# EAGLE design PiBackPlaneConnector-V1 (EAGLE 7.4.0)
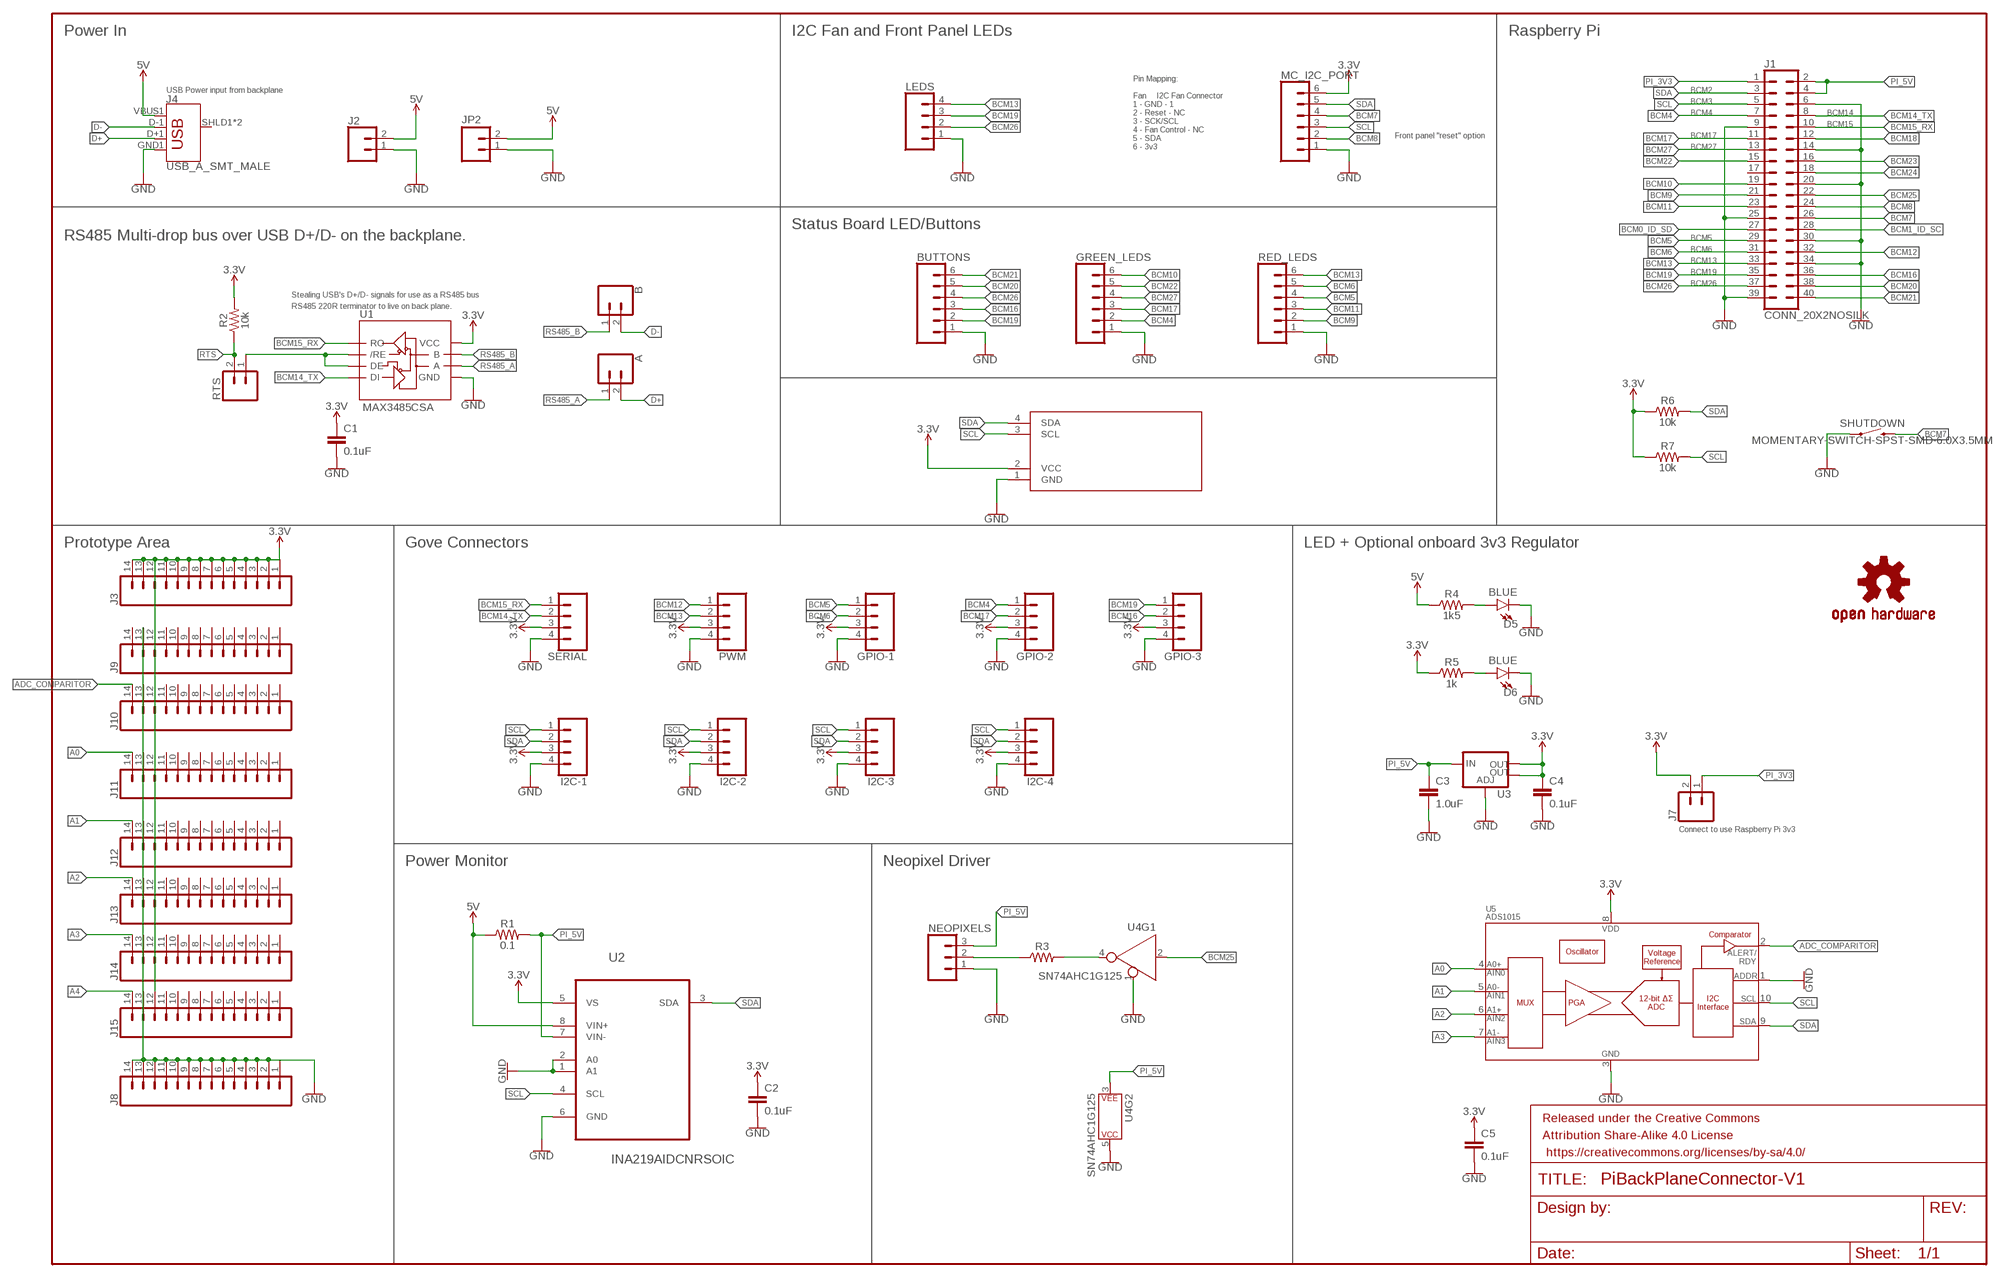
[diagram p0: schematic, sheet 1]

## Parts
A  CONN_02  [1X02]
B  CONN_02  [1X02]
BUTTONS  CONN_06SMD-1MM  [1X06-1MM]
C1  0.1uF  1.0UF-0805-25V-(+80/-20%)  [0805]
C2  0.1uF  1.0UF-0805-25V-(+80/-20%)  [0805]
C3  1.0uF  1.0UF-0805-25V-(+80/-20%)  [0805]
C4  0.1uF  1.0UF-0805-25V-(+80/-20%)  [0805]
C5  0.1uF  1.0UF-0805-25V-(+80/-20%)  [0805]
D5  BLUE  LED-BLUE1206  [LED-1206]
D6  BLUE  LED-BLUE1206  [LED-1206]
DISPLAY  DISPLAY0.91_INCH_DISPLAY  [I2C_DISPLAY_0.91_INCH]
FRAME1  FRAME-LEDGER  [CREATIVE_COMMONS]
GPIO-1  CONN_04JST-PTH-VERT  [JST-4-PTH-VERT]
GPIO-2  CONN_04JST-PTH-VERT  [JST-4-PTH-VERT]
GPIO-3  CONN_04JST-PTH-VERT  [JST-4-PTH-VERT]
GREEN_LEDS  CONN_06SMD-1MM  [1X06-1MM]
I2C-1  CONN_04JST-PTH-VERT  [JST-4-PTH-VERT]
I2C-2  CONN_04JST-PTH-VERT  [JST-4-PTH-VERT]
I2C-3  CONN_04JST-PTH-VERT  [JST-4-PTH-VERT]
I2C-4  CONN_04JST-PTH-VERT  [JST-4-PTH-VERT]
J1  CONN_20X2NOSILK  [2X20_NOSILK]
J2  CONN_02POLAR  [MOLEX-1X2]
J3  CONN_14  [1X14]
J4  USB_A_SMT_MALE  [USB-A-SMT-MALE]
J7  CONN_02  [1X02]
J8  CONN_14  [1X14]
J9  CONN_14NO_SILK  [1X14_NO_SILK]
J10  CONN_14NO_SILK  [1X14_NO_SILK]
J11  CONN_14NO_SILK  [1X14_NO_SILK]
J12  CONN_14NO_SILK  [1X14_NO_SILK]
J13  CONN_14NO_SILK  [1X14_NO_SILK]
J14  CONN_14NO_SILK  [1X14_NO_SILK]
J15  CONN_14NO_SILK  [1X14_NO_SILK]
JP2  M025MM  [SCREWTERMINAL-5MM-2@1]
LEDS  CONN_04SMD2  [1X04_1MM_RA]
LOGO1  OSHW-LOGOM  [OSHW-LOGO-M]
MC_I2C_PORT  CONN_06SMD-1MM  [1X06-1MM]
NEOPIXELS  CONN_03POLAR  [MOLEX-1X3]
PWM  CONN_04JST-PTH-VERT  [JST-4-PTH-VERT]
R1  0.1  0.1OHM-1210-1/2W-1%  [1210]
R2  10k  RESISTOR0805  [0805]
R3  RESISTOR0805  [0805]
R4  1k5  RESISTOR0805  [0805]
R5  1k  RESISTOR0805  [0805]
R6  10k  RESISTOR0805  [0805]
R7  10k  RESISTOR0805  [0805]
RED_LEDS  CONN_06SMD-1MM  [1X06-1MM]
RTS  CONN_02  [1X02]
SERIAL  CONN_04JST-PTH-VERT  [JST-4-PTH-VERT]
SHUTDOWN  MOMENTARY-SWITCH-SPST-SMD-6.0X3.5MM  [TACTILE_SWITCH_SMD_6.0X3.5MM]
U1  MAX3485CSA  RS485SOIC  [SO08]
U2  INA219AIDCNRSOIC  [SO08]
U3  V_REG_LM1117SOT223  [SOT223]
U4  SN74AHC1G125  74AHC1G125D  [SOT23-5]
U5  ADS1015  [MSOP10]

## Nets
3.3V: C1.1 C2.1 C4.1 C5.1 DISPLAY.2(VCC) GPIO-1.3 GPIO-2.3 GPIO-3.3 I2C-1.3 I2C-2.3 I2C-3.3 I2C-4.3 J3.1 J3.2 J3.3 J3.4 J3.5 J3.6 J3.7 J3.8 J3.9 J3.10 J3.11 J3.12 J3.13 J3.14 J7.2 J9.12 J10.12 J11.12 J12.12 J13.12 J14.12 J15.12 MC_I2C_PORT.6 PWM.3 R2.2 R5.1 R6.1 R7.1 SERIAL.3 U1.8(VCC) U2.5(VS) U3.2(OUT) U3.4(OUT) U5.8(VDD)
5V: J2.2 J4.VBUS1(VBUS) JP2.2 R1.1 R4.1 U2.8(VIN+)
A0: J11.14 U5.4(AIN0)
A1: J12.14 U5.5(AIN1)
A2: J13.14 U5.6(AIN2)
A3: J14.14 U5.7(AIN3)
A4: J15.14
ADC_COMPARITOR: J10.14 U5.2(ALERT/RDY)
BCM0_ID_SD: J1.27
BCM1_ID_SC: J1.28
BCM4: GPIO-2.1 GREEN_LEDS.2 J1.7
BCM5: GPIO-1.1 J1.29 RED_LEDS.4
BCM6: GPIO-1.2 J1.31 RED_LEDS.5
BCM7: J1.26 MC_I2C_PORT.4 SHUTDOWN.2
BCM8: J1.24 MC_I2C_PORT.2
BCM9: J1.21 RED_LEDS.2
BCM10: GREEN_LEDS.6 J1.19
BCM11: J1.23 RED_LEDS.3
BCM12: J1.32 PWM.1
BCM13: J1.33 LEDS.4 PWM.2 RED_LEDS.6
BCM14_TX: J1.8 SERIAL.2 U1.4(DI)
BCM15_RX: J1.10 SERIAL.1 U1.1(RO)
BCM16: BUTTONS.3 GPIO-3.2 J1.36
BCM17: GPIO-2.2 GREEN_LEDS.3 J1.11
BCM18: J1.12
BCM19: BUTTONS.2 GPIO-3.1 J1.35 LEDS.3
BCM20: BUTTONS.5 J1.38
BCM21: BUTTONS.6 J1.40
BCM22: GREEN_LEDS.5 J1.15
BCM23: J1.16
BCM24: J1.18
BCM25: J1.22 U4.2(A)
BCM26: BUTTONS.4 J1.37 LEDS.2
BCM27: GREEN_LEDS.4 J1.13
D+: A.2 J4.D+1(D+)
D-: B.2 J4.D-1(D-)
GND: BUTTONS.1 C1.2 C2.2 C3.2 C4.2 C5.2 D5.C D6.C DISPLAY.1(GND) GPIO-1.4 GPIO-2.4 GPIO-3.4 GREEN_LEDS.1 I2C-1.4 I2C-2.4 I2C-3.4 I2C-4.4 J1.6 J1.9 J1.14 J1.20 J1.25 J1.30 J1.34 J1.39 J2.1 J4.GND1(GND) J8.1 J8.2 J8.3 J8.4 J8.5 J8.6 J8.7 J8.8 J8.9 J8.10 J8.11 J8.12 J8.13 J8.14 J9.13 J10.13 J11.13 J12.13 J13.13 J14.13 J15.13 JP2.1 LEDS.1 MC_I2C_PORT.1 NEOPIXELS.1 PWM.4 RED_LEDS.1 SERIAL.4 SHUTDOWN.1 U1.5(GND) U2.1(A1) U2.2(A0) U2.6(GND) U3.1(ADJ) U4.1(!EN) U4.5(P$V+) U5.1(ADDR) U5.3(VSS)
N$2: D6.A R5.2
N$4: D5.A R4.2
N$6: RTS.1 U1.2(/RE) U1.3(DE)
N$8: NEOPIXELS.2 R3.1
N$9: R3.2 U4.4(Y)
PI_3V3: J1.1 J7.1
PI_5V: C3.1 J1.2 J1.4 NEOPIXELS.3 R1.2 U2.7(VIN-) U3.3(IN) U4.3(P$V-)
RS485_A: A.1 U1.6(A)
RS485_B: B.1 U1.7(B)
RTS: R2.1 RTS.2
SCL: DISPLAY.3(SCL) I2C-1.1 I2C-2.1 I2C-3.1 I2C-4.1 J1.5 MC_I2C_PORT.3 R7.2 U2.4(SCL) U5.10(SCL)
SDA: DISPLAY.4(SDA) I2C-1.2 I2C-2.2 I2C-3.2 I2C-4.2 J1.3 MC_I2C_PORT.5 R6.2 U2.3(SDA) U5.9(SDA)
Unconnected: J1.17 J4.SHLD1(SHIELD) J4.SHLD2(SHIELD) J9.1 J9.2 J9.3 J9.4 J9.5 J9.6 J9.7 J9.8 J9.9 J9.10 J9.11 J9.14 J10.1 J10.2 J10.3 J10.4 J10.5 J10.6 J10.7 J10.8 J10.9 J10.10 J10.11 J11.1 J11.2 J11.3 J11.4 J11.5 J11.6 J11.7 J11.8 J11.9 J11.10 J11.11 J12.1 J12.2 J12.3 J12.4 J12.5 J12.6 J12.7 J12.8 J12.9 J12.10 J12.11 J13.1 J13.2 J13.3 J13.4 J13.5 J13.6 J13.7 J13.8 J13.9 J13.10 J13.11 J14.1 J14.2 J14.3 J14.4 J14.5 J14.6 J14.7 J14.8 J14.9 J14.10 J14.11 J15.1 J15.2 J15.3 J15.4 J15.5 J15.6 J15.7 J15.8 J15.9 J15.10 J15.11

## Notes on the sheet
- Power In | I2C Fan and Front Panel LEDs | Raspberry Pi
- USB Power input from backplane | BCM2
- BCM3
- BCM4 | BCM14
- BCM15
- Front panel "reset" option | BCM17
- Pin Mapping:
  
  Fan     I2C Fan Connector
  1 - GND - 1
  2 - Reset - NC
  3 - SCK/SCL
  4 - Fan Control - NC
  5 - SDA
  6 - 3v3
- BCM27
- Status Board LED/Buttons
- RS485 Multi-drop bus over USB D+/D- on the backplane. | BCM5
- BCM6
- BCM13
- BCM19
- BCM26
- Stealing USB's D+/D- signals for use as a RS485 bus
- RS485 220R terminator to live on back plane.
- Prototype Area | Gove Connectors | LED + Optional onboard 3v3 Regulator
- Connect to use Raspberry Pi 3v3
- Power Monitor | Neopixel Driver

## Library data of the parts
A B J7 RTS = SparkFun-Connectors:CONN_02: Multi connection point. Often used as Generic Header-pin footprint for 0.1 inch spaced/style header connections On any of the 0.1 inch spaced packages, you can populate with these: Break Away Headers - Straight <https://www.sparkfun.com/products/116> (PRT-00116) Break Away Male Headers - Right Angle <https://www.sparkfun.com/products/553> (PRT-00553) Female Headers <https://www.sparkfun.com/products/115> (PRT-00115) Break Away Headers - Machine Pin <https://www.sparkfun.com/products/117> (PRT-00117) Break Away Female Headers - Swiss Machine Pin <https://www.sparkfun.com/products/743> (PRT-00743) For SCREWTERMINALS and SPRING TERMINALS visit here: Screw Terimnals on SparkFun.com <https://www.sparkfun.com/search/results?term=Screw+Terminals> (5mm/3.5mm/2.54mm spacing) This device is also useful as a general connection point to wire up your design to another part of your project. Our various solder wires solder well into these plated through hole pads. Hook-Up Wire - Assortment (Stranded, 22 AWG) <https://www.sparkfun.com/products/11375> (PRT-11375) Hook-Up Wire - Assortment (Solid Core, 22 AWG) <https://www.sparkfun.com/products/11367> (PRT-11367) View the entire wire category on our website here <https://www.sparkfun.com/categories/141> Special notes: Molex polarized connector foot print use with: PRT-08233 with associated crimp pins and housings. 2.54_SCREWTERM for use with PRT-10571. 3.5mm Screw Terminal footprints for PRT-08084 5mm Screw Terminal footprints for use with PRT-08432
BUTTONS GREEN_LEDS MC_I2C_PORT RED_LEDS = SparkFun-Connectors:CONN_06: Multi connection point. Often used as Generic Header-pin footprint for 0.1 inch spaced/style header connections On any of the 0.1 inch spaced packages, you can populate with these: Break Away Headers - Straight <https://www.sparkfun.com/products/116> (PRT-00116) Break Away Male Headers - Right Angle <https://www.sparkfun.com/products/553> (PRT-00553) Female Headers <https://www.sparkfun.com/products/115> (PRT-00115) Break Away Headers - Machine Pin <https://www.sparkfun.com/products/117> (PRT-00117) Break Away Female Headers - Swiss Machine Pin <https://www.sparkfun.com/products/743> (PRT-00743) Arduino Stackable Header - 6 Pin <https://www.sparkfun.com/products/9280> (PRT-09280) For SCREWTERMINALS and SPRING TERMINALS visit here: Screw Terimnals on SparkFun.com <https://www.sparkfun.com/search/results?term=Screw+Terminals> (5mm/3.5mm/2.54mm spacing) This device is also useful as a general connection point to wire up your design to another part of your project. Our various solder wires solder well into these plated through hole pads. Hook-Up Wire - Assortment (Stranded, 22 AWG) <https://www.sparkfun.com/products/11375> (PRT-11375) Hook-Up Wire - Assortment (Solid Core, 22 AWG) <https://www.sparkfun.com/products/11367> (PRT-11367) View the entire wire category on our website here <https://www.sparkfun.com/categories/141>; PROD_ID: CONN-08249; SF_ID: GPS-00579
C1 C2 C4 C5 = SparkFun-Capacitors:1.0UF: 1µF ceramic capacitors A capacitor is a passive two-terminal electrical component used to store electrical energy temporarily in an electric field.; PROD_ID: CAP-11625; VALUE: 1.0uF
C3 = SparkFun-Capacitors:1.0UF: 1µF ceramic capacitors A capacitor is a passive two-terminal electrical component used to store electrical energy temporarily in an electric field.; PROD_ID: CAP-11625
D5 D6 = SparkFun-LED:LED-BLUE: Blue SMD LED Used in manufacturing of various products at SparkFun Packages: 0603 - SMD 0603 package [Product Link] <http://www.digikey.com/product-detail/en/SMLE12BC7TT86/511-1589-2-ND/1641808> 1206 - SMD1206 package [Product Link] <http://www.digikey.com/product-detail/en/lite-on-inc/LTST-C150TBKT/160-1643-1-ND/573584> SparkFun Products: ESP8266 Thing-Dev Board <https://www.sparkfun.com/products/13711> RedBoard <https://www.sparkfun.com/products/12757>; PROD_ID: DIO-09911
DISPLAY = ThingySticks:DISPLAY
FRAME1 = SparkFun-Aesthetics:FRAME-LEDGER: Schematic Frame - Ledger Standard 11x14 US Ledger frame
GPIO-1-GPIO-3 I2C-1-I2C-4 PWM SERIAL = SparkFun-Connectors:CONN_04: Multi connection point. Often used as Generic Header-pin footprint for 0.1 inch spaced/style header connections On any of the 0.1 inch spaced packages, you can populate with these: Break Away Headers - Straight <https://www.sparkfun.com/products/116> (PRT-00116) Break Away Male Headers - Right Angle <https://www.sparkfun.com/products/553> (PRT-00553) Female Headers <https://www.sparkfun.com/products/115> (PRT-00115) Break Away Headers - Machine Pin <https://www.sparkfun.com/products/117> (PRT-00117) Break Away Female Headers - Swiss Machine Pin <https://www.sparkfun.com/products/743> (PRT-00743) For SCREWTERMINALS and SPRING TERMINALS visit here: Screw Terimnals on SparkFun.com <https://www.sparkfun.com/search/results?term=Screw+Terminals> (5mm/3.5mm/2.54mm spacing) This device is also useful as a general connection point to wire up your design to another part of your project. Our various solder wires solder well into these plated through hole pads. Hook-Up Wire - Assortment (Stranded, 22 AWG) <https://www.sparkfun.com/products/11375> (PRT-11375) Hook-Up Wire - Assortment (Solid Core, 22 AWG) <https://www.sparkfun.com/products/11367> (PRT-11367) View the entire wire category on our website here <https://www.sparkfun.com/categories/141> Special notes: Molex polarized connector foot print use with SKU : PRT-08231 with associated crimp pins and housings. 1MM SMD Version SKU: PRT-10208; PROD_ID: CONN-13251
J1 = SparkFun-Connectors:CONN_20X2: Multi connection point. Often used as Generic Header-pin footprint for 0.1 inch spaced/style header connections On any of the 0.1 inch spaced packages, you can populate with these: Break Away Headers - Straight <https://www.sparkfun.com/products/116> (PRT-00116) Break Away Male Headers - Right Angle <https://www.sparkfun.com/products/553> (PRT-00553) Female Headers <https://www.sparkfun.com/products/115> (PRT-00115) Break Away Headers - Machine Pin <https://www.sparkfun.com/products/117> (PRT-00117) Break Away Female Headers - Swiss Machine Pin <https://www.sparkfun.com/products/743> (PRT-00743)
J2 = SparkFun-Connectors:CONN_02: Multi connection point. Often used as Generic Header-pin footprint for 0.1 inch spaced/style header connections On any of the 0.1 inch spaced packages, you can populate with these: Break Away Headers - Straight <https://www.sparkfun.com/products/116> (PRT-00116) Break Away Male Headers - Right Angle <https://www.sparkfun.com/products/553> (PRT-00553) Female Headers <https://www.sparkfun.com/products/115> (PRT-00115) Break Away Headers - Machine Pin <https://www.sparkfun.com/products/117> (PRT-00117) Break Away Female Headers - Swiss Machine Pin <https://www.sparkfun.com/products/743> (PRT-00743) For SCREWTERMINALS and SPRING TERMINALS visit here: Screw Terimnals on SparkFun.com <https://www.sparkfun.com/search/results?term=Screw+Terminals> (5mm/3.5mm/2.54mm spacing) This device is also useful as a general connection point to wire up your design to another part of your project. Our various solder wires solder well into these plated through hole pads. Hook-Up Wire - Assortment (Stranded, 22 AWG) <https://www.sparkfun.com/products/11375> (PRT-11375) Hook-Up Wire - Assortment (Solid Core, 22 AWG) <https://www.sparkfun.com/products/11367> (PRT-11367) View the entire wire category on our website here <https://www.sparkfun.com/categories/141> Special notes: Molex polarized connector foot print use with: PRT-08233 with associated crimp pins and housings. 2.54_SCREWTERM for use with PRT-10571. 3.5mm Screw Terminal footprints for PRT-08084 5mm Screw Terminal footprints for use with PRT-08432; SF_ID: PRT-09918
J3 J8-J15 = SparkFun-Connectors:CONN_14: Multi connection point. Often used as Generic Header-pin footprint for 0.1 inch spaced/style header connections On any of the 0.1 inch spaced packages, you can populate with these: Break Away Headers - Straight <https://www.sparkfun.com/products/116> (PRT-00116) Break Away Male Headers - Right Angle <https://www.sparkfun.com/products/553> (PRT-00553) Female Headers <https://www.sparkfun.com/products/115> (PRT-00115) Break Away Headers - Machine Pin <https://www.sparkfun.com/products/117> (PRT-00117) Break Away Female Headers - Swiss Machine Pin <https://www.sparkfun.com/products/743> (PRT-00743) For SCREWTERMINALS and SPRING TERMINALS visit here: Screw Terimnals on SparkFun.com <https://www.sparkfun.com/search/results?term=Screw+Terminals> (5mm/3.5mm/2.54mm spacing) This device is also useful as a general connection point to wire up your design to another part of your project. Our various solder wires solder well into these plated through hole pads. Hook-Up Wire - Assortment (Stranded, 22 AWG) <https://www.sparkfun.com/products/11375> (PRT-11375) Hook-Up Wire - Assortment (Solid Core, 22 AWG) <https://www.sparkfun.com/products/11367> (PRT-11367) View the entire wire category on our website here <https://www.sparkfun.com/categories/141> Special notes: Molex polarized connector foot print use with SKU : PRT-08231 with associated crimp pins and housings. 1MM SMD Version SKU: PRT-10208 NOTES ON THE VARIANTS LOCK and LOCK_LONGPADS... This footprint was designed to help hold the alignment of a through-hole component (i.e. 6-pin header) while soldering it into place. You may notice that each hole has been shifted either up or down by 0.005 of an inch from it's more standard position (which is a perfectly straight line). This slight alteration caused the pins (the squares in the middle) to touch the edges of the holes. Because they are alternating, it causes a "brace" to hold the component in place. 0.005 has proven to be the perfect amount of "off-center" position when using our standard breakaway headers. Although looks a little odd when you look at the bare footprint, once you have a header in there, the alteration is very hard to notice. Also,if you push a header all the way into place, it is covered up entirely on the bottom side.
J4 = Tinamous:USB_A: USB-A Connector Male and female variants, as well as PTH and SMT variants SparkFun Products: SparkFun XBee Explorer Dongle <https://www.sparkfun.com/products/11697> PTH Male SparkFun MicroView-USB Programmer <https://www.sparkfun.com/products/12924> SMT Male SparkFun USB Type A Female Breakout <https://www.sparkfun.com/products/12700> SMT Female; PROD_ID: CONN-11499
JP2 = SparkFun-Connectors:M02: Standard 2-pin 0.1" header. Use with - straight break away headers ( PRT-00116) - right angle break away headers (PRT-00553) - swiss pins (PRT-00743) - machine pins (PRT-00117) - female headers (PRT-00115) Molex polarized connector foot print use with: PRT-08233 with associated crimp pins and housings. 2.54_SCREWTERM for use with PRT-10571. 3.5mm Screw Terminal footprints for PRT-08084 5mm Screw Terminal footprints for use with PRT-08432; STOREFRONT_ID: PRT-08432
LEDS = SparkFun-Connectors:CONN_04: Multi connection point. Often used as Generic Header-pin footprint for 0.1 inch spaced/style header connections On any of the 0.1 inch spaced packages, you can populate with these: Break Away Headers - Straight <https://www.sparkfun.com/products/116> (PRT-00116) Break Away Male Headers - Right Angle <https://www.sparkfun.com/products/553> (PRT-00553) Female Headers <https://www.sparkfun.com/products/115> (PRT-00115) Break Away Headers - Machine Pin <https://www.sparkfun.com/products/117> (PRT-00117) Break Away Female Headers - Swiss Machine Pin <https://www.sparkfun.com/products/743> (PRT-00743) For SCREWTERMINALS and SPRING TERMINALS visit here: Screw Terimnals on SparkFun.com <https://www.sparkfun.com/search/results?term=Screw+Terminals> (5mm/3.5mm/2.54mm spacing) This device is also useful as a general connection point to wire up your design to another part of your project. Our various solder wires solder well into these plated through hole pads. Hook-Up Wire - Assortment (Stranded, 22 AWG) <https://www.sparkfun.com/products/11375> (PRT-11375) Hook-Up Wire - Assortment (Solid Core, 22 AWG) <https://www.sparkfun.com/products/11367> (PRT-11367) View the entire wire category on our website here <https://www.sparkfun.com/categories/141> Special notes: Molex polarized connector foot print use with SKU : PRT-08231 with associated crimp pins and housings. 1MM SMD Version SKU: PRT-10208; PROD_ID: CONN-10310; SF_ID: PRT-10208
LOGO1 = Tinamous:OSHW-LOGO: Open Source Hardware Logo This logo indicates the piece of hardware it is found on incorporates a OSHW license and/or adheres to the definition of open source hardware found here: http://freedomdefined.org/OSHW
NEOPIXELS = SparkFun-Connectors:CONN_03: Multi connection point. Often used as Generic Header-pin footprint for 0.1 inch spaced/style header connections On any of the 0.1 inch spaced packages, you can populate with these: Break Away Headers - Straight <https://www.sparkfun.com/products/116> (PRT-00116) Break Away Male Headers - Right Angle <https://www.sparkfun.com/products/553> (PRT-00553) Female Headers <https://www.sparkfun.com/products/115> (PRT-00115) Break Away Headers - Machine Pin <https://www.sparkfun.com/products/117> (PRT-00117) Break Away Female Headers - Swiss Machine Pin <https://www.sparkfun.com/products/743> (PRT-00743) Stackable Header - 3 Pin (Female, 0.1") <https://www.sparkfun.com/products/13875> (PRT-13875) For SCREWTERMINALS and SPRING TERMINALS visit here: Screw Terimnals on SparkFun.com <https://www.sparkfun.com/search/results?term=Screw+Terminals> (5mm/3.5mm/2.54mm spacing) This device is also useful as a general connection point to wire up your design to another part of your project. Our various solder wires solder well into these plated through hole pads. Hook-Up Wire - Assortment (Stranded, 22 AWG) <https://www.sparkfun.com/products/11375> (PRT-11375) Hook-Up Wire - Assortment (Solid Core, 22 AWG) <https://www.sparkfun.com/products/11367> (PRT-11367) View the entire wire category on our website here <https://www.sparkfun.com/categories/141> Special notes: Molex polarized connector foot print use with SKU : PRT-08232 with associated crimp pins and housings.; PROD_ID: CONN-08625; SF_ID: PRT-08096
R1 = SparkFun-Resistors:0.1OHM: 0.1Ω resistor A resistor is a passive two-terminal electrical component that implements electrical resistance as a circuit element. Resistors act to reduce current flow, and, at the same time, act to lower voltage levels within circuits. - Wikipedia; PROD_ID: RES-12374
R2-R7 = SparkFun-Resistors:RESISTOR: Generic Resistor Package
SHUTDOWN = ThingySticks:MOMENTARY-SWITCH-SPST: Momentary Switch (Pushbutton) - SPST Normally-open (NO) SPST momentary switches (buttons, pushbuttons). Variants PTH-12MM - 12mm square, through-hole Momentary Pushbutton Switch - 12mm Square <https://www.sparkfun.com/products/9190> (COM-09190) PTH-6.0MM, PTH-6.0MM-KIT - 6.0mm square, through-hole Mini Pushbutton Switch <https://www.sparkfun.com/products/97> (COM-00097) KIT package intended for soldering kit's - only one side of pads' copper is exposed. PTH-RIGHT-ANGLE-KIT - Right-angle, through-hole Right Angle Tactile Button <https://www.sparkfun.com/products/10791> - Used on SparkFun BigTime Watch Kit <https://www.sparkfun.com/products/11734> SMD-12MM - 12mm square, surface-mount Tactile Button - SMD (12mm) <https://www.sparkfun.com/products/12993> (COM-12993) Used on SparkFun PicoBoard <https://www.sparkfun.com/products/11888> SMD-4.5MM - 4.5mm Square Trackball Switch Used on SparkFun Blackberry Trackballer Breakout <https://www.sparkfun.com/products/13169> SMD-4.6MMX2.8MM - 4.60mm x 2.80mm, surface mount Used on SparkFun SAMD21 Mini Breakout <https://www.sparkfun.com/products/13664> SMD-5.2MM, SMD-5.2-REDUNDANT - 5.2mm square, surface-mount Mini Pushbutton Switch - SMD <https://www.sparkfun.com/products/8720> (COM-08720) Used on Arduino Pro Mini <https://www.sparkfun.com/products/11114> REDUNDANT package connects both switch circuits together SMD-6.0X3.5MM - 6.0 x 3.5mm, surface mount Momentary Reset Switch SMD <https://www.sparkfun.com/products/8229> (COM-08229) SMD-6.2MM-TALL - 6.2mm square, surface mount Tactile Button - SMD (6mm) <https://www.sparkfun.com/products/12992> Used on SparkFun Digital Sandbox <https://www.sparkfun.com/products/12651> SMD-RIGHT-ANGLE - Right-angle, surface mount Used on SparkFun Block for Intel® Edison - Arduino <https://www.sparkfun.com/products/13036>; PROD_ID: SWCH-00815; SF_SKU: COM-08229
U1 = SparkFun-IC-Comms:RS485: RS-485 Transceiver SP3485 Series 8 Pin NSOIC 3.3 V Low Power Half Duplex RS-485 Transceiver MAX3485 compatible Datasheet <http://www.sparkfun.com/datasheets/Components/General/sp3485CN-LTR.pdf> SparkFun Products SparkFun Transceiver Breakout - RS-485 <https://www.sparkfun.com/products/10124> (BOB-10124) SparkFun USB to RS-485 Converter <https://www.sparkfun.com/products/9822> (BOB-09822); PROD_ID: IC-09388
U2 = INA219AIDCNR:INA219AIDCNR: CURRENT/POWER MONITOR
U3 = SparkFun-PowerIC:V_REG_LM1117: Voltage Regulator LM1117 Standard adjustable voltage regulator but in SMD form. Spark Fun Electronics SKU : COM-00595; PROD_ID: VREG-08170
U4 = SparkFun-IC-Logic:74*1G125: Single buffer Buffers & Line Drivers Tri-State Single Bus SOT-23-5 Datasheet SparkFun Products SparkFun SAMD21 Mini Breakout <https://www.sparkfun.com/products/13664> (DEV-13664) SparkFun SAMD21 Dev Breakout <https://www.sparkfun.com/products/13672> (DEV-13672) SparkFun MIDI Shield <https://www.sparkfun.com/products/12898> (DEV-12898) SparkFun WiFi Shield - CC3000 <https://www.sparkfun.com/products/12071> (DEV-12071); PROD_ID: IC-11920
U5 = SparkFun-IC-Conversion:ADS1015: ADS1015 12-BIT ADC 12-Bit Del-Sig ADC Four single-ended inputs or two differential inputs Internal PGA I2C interface 2.0-5.5V SparkFun Products SparkFun Block for Intel Edison - ADC <https://www.sparkfun.com/products/13770> (DEV-13770); PROD_ID: IC-12270

## Board
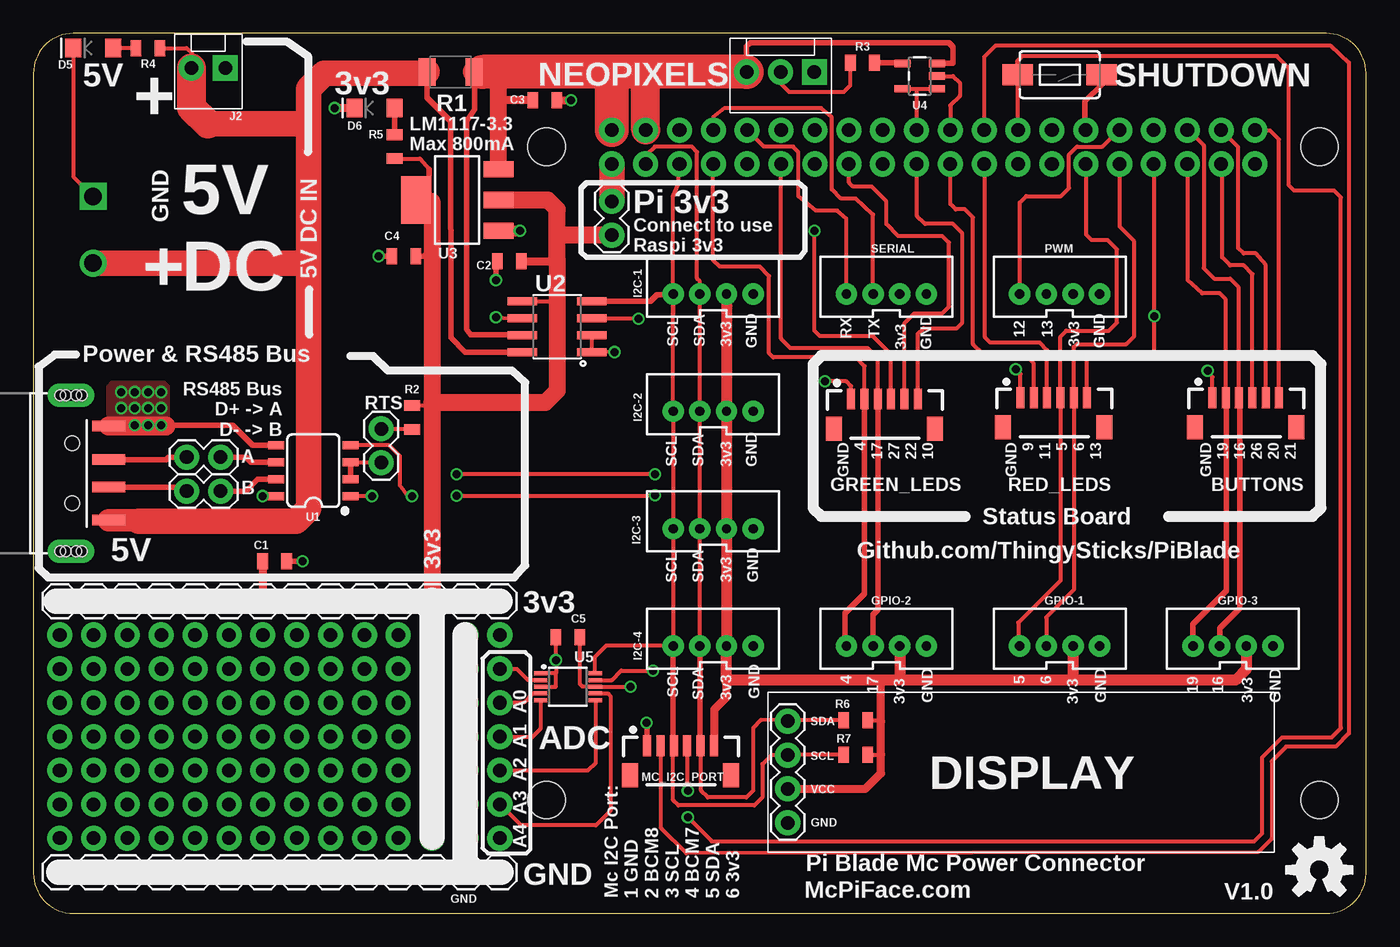
[diagram p1: board, top side]
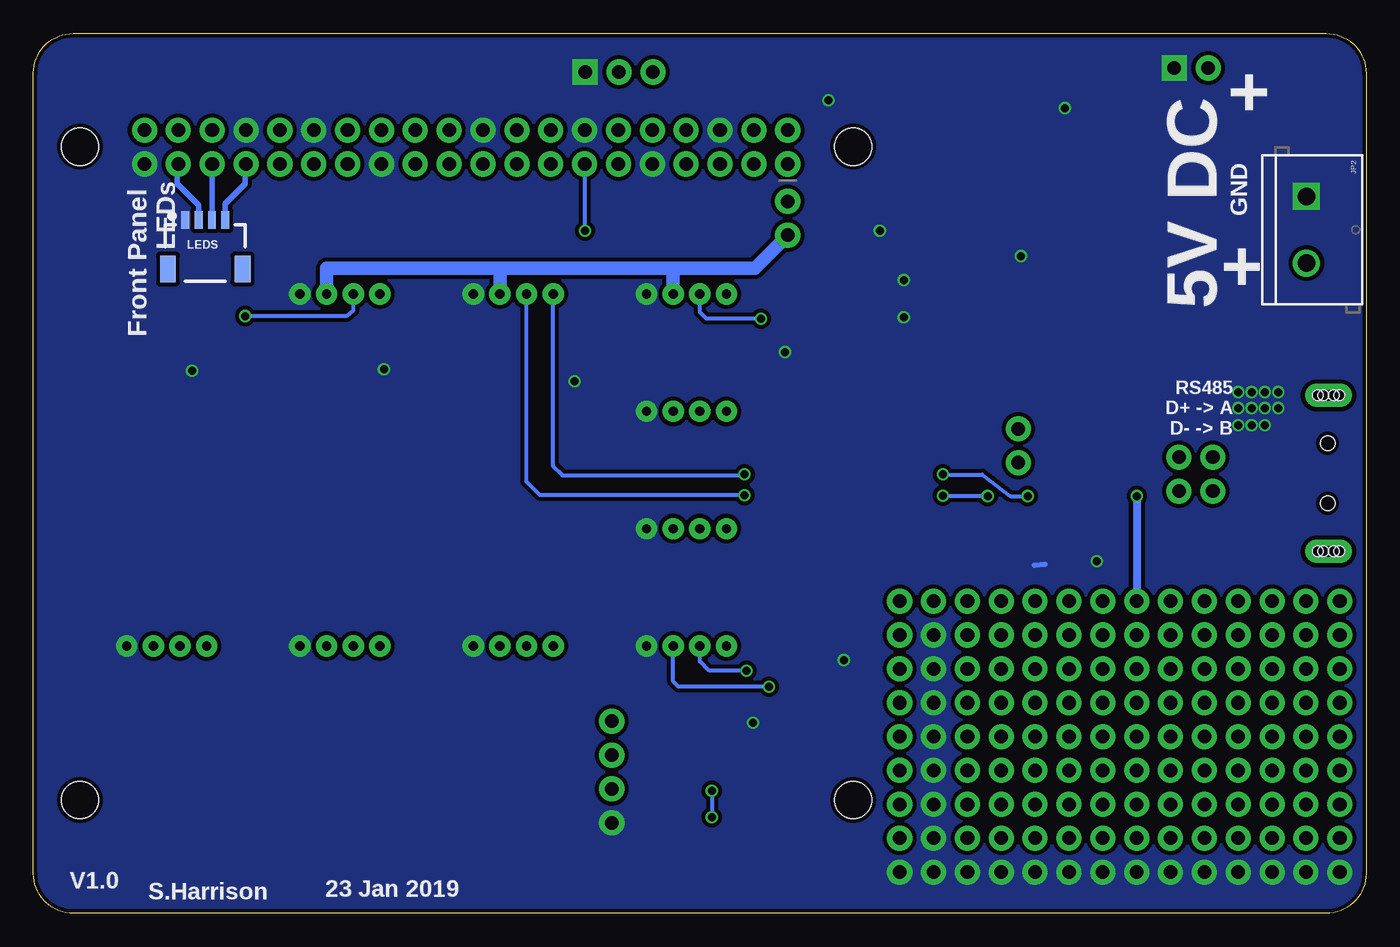
[diagram p2: board, bottom side, seen from below]

Size 100 x 66 mm. Coordinates in mm from the lower left corner, seen from the top.
Outline: 0,3 arc90 3,0 97,0 arc90 100,3 100,63 arc90 97,66 3,66 arc90 0,63 0,3
Copper layers (1*16): Top 0.035mm / dielectric 1.5mm / Bottom 0.035mm
Design rules "dirt_cheap_dirty_boards.v1": minimum track width 5mil, minimum drill 12mil, track to track 5mil, track to pad 5mil, pad to pad 5mil, via to via 5mil, smd to smd 0mil, copper to edge 10mil, drill to drill 10mil, minimum pad ring 10mil, minimum via ring 6mil, stop-mask expansion 2mil, vias tented up to drill 25mil, thermal gap 10mil
Holes 2.8 mm at 38.5,57.5 96.5,57.5 38.5,8.5 96.5,8.5

### Footprints (pad centres in the part's own frame; a part is rotated, then mirrored left to right if it is on the bottom)
1X02 = drill 1.016 pad 1.88: 1 0,0; 2 2.54,0
1X06-1MM = smd 0.6 x 1.55: 1 -2.54,1.27; 2 -1.54,1.27; 3 -0.54,1.27; 4 0.46,1.27; 5 1.46,1.27; 6 2.46,1.27 | smd 1.2 x 1.8: P$1 -3.84,-0.955; P$2 3.76,-0.955
0805 = smd 0.8 x 1.2: 1 -0.9,0; 2 0.9,0
LED-1206 = smd 1.2 x 1.4: A -1.5,0; C 1.5,0
I2C_DISPLAY_0.91_INCH = drill 1.016 pad 1.88: 1 1.5,2.19; 2 1.5,4.73; 3 1.5,7.27; 4 1.5,9.81
JST-4-PTH-VERT = drill 0.7 pad 1.6: 1 -3,-0.55; 2 -1,-0.55; 3 1,-0.55; 4 3,-0.55
2X20_NOSILK = drill 1.016 pad 1.88: 1 0,0; 2 0,2.54; 3 2.54,0; 4 2.54,2.54; 5 5.08,0; 6 5.08,2.54; 7 7.62,0; 8 7.62,2.54; 9 10.16,0; 10 10.16,2.54; 11 12.7,0; 12 12.7,2.54; 13 15.24,0; 14 15.24,2.54; 15 17.78,0; 16 17.78,2.54; 17 20.32,0; 18 20.32,2.54; 19 22.86,0; 20 22.86,2.54; 21 25.4,0; 22 25.4,2.54; 23 27.94,0; 24 27.94,2.54; 25 30.48,0; 26 30.48,2.54; 27 33.02,0; 28 33.02,2.54; 29 35.56,0; 30 35.56,2.54; 31 38.1,0; 32 38.1,2.54; 33 40.64,0; 34 40.64,2.54; 35 43.18,0; 36 43.18,2.54; 37 45.72,0; 38 45.72,2.54; 39 48.26,0; 40 48.26,2.54
MOLEX-1X2 = drill 1.016 pad 1.88 square: 1 0,0 | drill 1.016 pad 1.88: 2 2.54,0
1X14 = drill 1.016 pad 1.88: 1 0,0; 2 2.54,0; 3 5.08,0; 4 7.62,0; 5 10.16,0; 6 12.7,0; 7 15.24,0; 8 17.78,0; 9 20.32,0; 10 22.86,0; 11 25.4,0; 12 27.94,0; 13 30.48,0; 14 33.02,0
USB-A-SMT-MALE = smd 2.5 x 0.8: D+1 10.95,1.027; D-1 10.95,-1.027; GND1 10.95,3.551; VBUS1 10.95,-3.5 | drill 0.8 pad 1.778 long: SHLD1 8.13,-5.85; SHLD2 8.13,5.85 | hole 1.1: 8.2,2.25; 8.2,-2.25 | hole 0.8: 8.53,-5.85; 8.93,-5.85; 7.73,-5.85; 7.33,-5.85; 8.53,5.85; 8.93,5.85; 7.73,5.85; 7.33,5.85
1X14_NO_SILK = drill 1.016 pad 1.88: 1 0,0; 2 2.54,0; 3 5.08,0; 4 7.62,0; 5 10.16,0; 6 12.7,0; 7 15.24,0; 8 17.78,0; 9 20.32,0; 10 22.86,0; 11 25.4,0; 12 27.94,0; 13 30.48,0; 14 33.02,0
SCREWTERMINAL-5MM-2@1 = drill 1.3 pad 2.032 square: 1 0,0 | drill 1.3 pad 2.032: 2 5,0
1X04_1MM_RA = smd 0.6 x 1.35: 1 -1.5,0; 2 -0.5,0; 3 0.5,0; 4 1.5,0 | smd 1.2 x 2: NC1 2.8,-3.675; NC2 -2.8,-3.675
MOLEX-1X3 = drill 1.016 pad 1.88 square: 1 0,0 | drill 1.016 pad 1.88: 2 2.54,0; 3 5.08,0
1210 = smd 1.27 x 2.06: 1 -1.755,0; 2 1.755,0
TACTILE_SWITCH_SMD_6.0X3.5MM = smd 2.3 x 1.6: 1 -3.15,0; 2 3.15,0
SO08 = smd 0.6 x 1.2: 1 -1.905,-2.8; 2 -0.635,-2.8; 3 0.635,-2.8; 4 1.905,-2.8; 5 1.905,2.8; 6 0.635,2.8; 7 -0.635,2.8; 8 -1.905,2.8
SO08' = smd 0.61 x 2.21: 1 -1.905,-2.616; 2 -0.635,-2.616; 3 0.635,-2.616; 4 1.905,-2.616; 5 1.905,2.616; 6 0.635,2.616; 7 -0.635,2.616; 8 -1.905,2.616
SOT223 = smd 1.219 x 2.235: 1 -2.311,-3.099; 2 0,-3.099; 3 2.311,-3.099 | smd 3.6 x 2.2: 4 0,3.099
SOT23-5 = smd 0.55 x 1.2: 1 -0.95,-1.3; 2 0,-1.3; 3 0.95,-1.3; 4 0.95,1.3; 5 -0.95,1.3
MSOP10 = smd 0.3 x 1: 1 -1,-2.05; 2 -0.5,-2.05; 3 0,-2.05; 4 0.5,-2.05; 5 1,-2.05; 6 1,2.05; 7 0.5,2.05; 8 0,2.05; 9 -0.5,2.05; 10 -1,2.05

### Placement (x,y rotation side)
A  14.05,34.21 180 top
B  14.05,31.67 180 top
BUTTONS  91,37.4 0 top
C1  18.1,26.4 0 top
C2  35.7,48.9 180 top
C3  38.37,60.97 0 top
C4  27.8,49.3 180 top
C5  40.1,20.7 180 top
D5  4.5,64.9 180 top
D6  25.6,60.4 180 top
DISPLAY  55.1,4.6 0 top
FRAME1  15.6,-10.6 0 top  (outside the outline)
GPIO-1  77,20.6 0 top
GPIO-2  64,20.6 0 top
GPIO-3  90,20.6 0 top
GREEN_LEDS  63.9,37.3 0 top
I2C-1  51,47 0 top
I2C-2  51,38.2 0 top
I2C-3  51,29.4 0 top
I2C-4  51,20.6 0 top
J1  43.4,56.2 0 top
J2  14.4,63.4 180 top
J3  1.98,23.41 0 top
J4  -5.3,33 0 top
J7  43.4,53.4 270 top
J8  1.98,3.09 0 top
J9  1.98,20.88 0 top
J10  1.98,18.34 0 top
J11  1.98,15.79 0 top
J12  1.98,13.26 0 top
J13  1.98,10.71 0 top
J14  1.98,8.18 0 top
J15  1.98,5.63 0 top
JP2  4.48,53.77 270 bottom
LEDS  87.1,52 0 bottom
LOGO1  96.48,3.26 0 bottom
MC_I2C_PORT  48.6,11.3 0 top
NEOPIXELS  58.6,63.1 180 top
PWM  77,47 0 top
R1  31.3,63.1 0 top
R2  28.4,37.2 90 top
R3  62.2,63.8 0 top
R4  8.6,64.9 180 top
R5  27.1,57.5 90 top
R6  61.7,14.5 180 top
R7  61.7,11.9 180 top
RED_LEDS  76.6,37.4 0 top
RTS  26.1,33.8 90 top
SERIAL  64,47 0 top
SHUTDOWN  77,62.9 180 top
U1  21,33.2 90 top
U2  INA219AIDCNRSOIC  [SO08']  39.3,44 90 top
U3  31.8,53.5 90 top
U4  66.5,62.8 90 top
U5  40.1,17 270 top

### Tracks (layer width: path | path; a pad name or v marks a point on that pad's centre or on a via)
3.3V  (via drill 0.6)
  Top 0.305: I2C-1.3 52.3,45.5 | U2.5 39.3,45.91 39.3,45 | R2.2 29.9,38.1 | 17.59,31.3 U1.8 | R5.1 29,56.6 29.7,55.8 | v44.8,17 U5.8 41.2,17 41,17.2 C5.1 | R6.1 63.5,14.5 63.6,14.4 | R7.1 63.6,11.9
  Top 0.406: 29.7,55.8 29.7,53.4 U3.4 | 51.1,14.8 51.09,12.71 | C4.1 29.8,49.3 29.9,49.4
  Top 0.61: MC_I2C_PORT.6 51.09,12.71 51.1,15.3 52,16.2 52,17.5 | J3.12 33.73,23.41 | v17.2,31.3 17.59,31.3 | C2.1 39.2,48.9 39.3,49 | DISPLAY.2 62.43,9.33 63.6,10.5 63.6,11.9 63.6,14.4 63.6,17.5 | C1.1 17.2,23.43 J3.7
  Top 0.813: I2C-1.3 I2C-2.3 I2C-3.3 I2C-4.3 52,17.5 63.6,17.5 65,17.5 | GPIO-1.3 78,17.5 | 78,17.5 65,17.5 | GPIO-2.3 65,17.5 | GPIO-3.3 91,18.3 90.2,17.5 78,17.5 | J3.1 J3.2 J3.3 J3.4 J3.5 J3.6 J3.7 J3.8 J3.9 J3.10 J3.11 J3.12 J3.13 33.73,23.41 J3.14
  Top 1.016: 29.7,53.4 29.9,53.4
  Top 1.27: 29.9,38.3 38.4,38.3 39.3,39.2 39.3,45 39.3,49 39.3,51.1 | 29.9,38.3 29.9,38.1 29.9,23.43 J3.12 | 29.9,53.4 29.9,49.4 29.9,38.3 | 39.3,51.1 39.3,52.8 38.6,53.5 U3.2 | J7.2 39.54,50.86 39.3,51.1
  Top 1.676: J3.12 J9.12 J10.12 J11.12 J12.12 J13.12 J14.12 J15.12
  Bottom 0.305: v44.8,17 51.6,17 52,17.4 I2C-4.3
  Bottom 0.61: v17.2,31.3 17.2,23.77
  Bottom 0.813: 17.2,23.77 17.2,23.43 J3.7
  Bottom 1.016: PWM.3 78,48.4 65,48.4 | 65,48.4 52,48.4 | 52,48.4 I2C-1.3 | SERIAL.3 65,48.4 | 52,48.4 45.86,48.4 J7.2
  Bottom 1.27: 14.5,23.59 J3.6
5V
  Top 0.305: 11.2,61.5 11.3,61.6 11.3,62.84 J2.2 11.9,63.44 11.9,64.5 11.5,64.9 R4.1
  Top 0.406: R1.1 29.55,61.16 31.3,59.4 31.34,43.16 32.4,42.1 35.78,42.1 U2.8
  Top 0.813: 7.7,29.4 7.8,29.5
  Top 1.676: J4.VBUS1 7.8,29.5 7.9,29.4
  Top 1.93: 7.9,29.4 19.7,29.4 20.64,30.34 20.64,48.9 | 20.64,48.9 20.64,59.2 | 20.64,59.2 20.64,61.84 21.8,63 29.45,63 R1.1 | 13.1,59.2 20.64,59.2 | JP2.2 20.01,48.77 20.64,48.9
  Top 2.184: J2.2 11.86,60.44 13.1,59.2
A0
  Top 0.305: U5.4 37.5,16.5 36.8,15.8 J11.14
A1
  Top 0.305: U5.5 38.05,13.85 37.4,13.2 35.05,13.2 J12.14
A2
  Top 0.305: J13.14 41.62,10.71 42.2,11.3 42.2,15.95 U5.6
A3
  Top 0.305: U5.7 43.1,16.5 43.3,16.3 43.3,7.7 42.2,6.6 36.58,6.6 J14.14
ADC_COMPARITOR
  Top 0.305: U5.2 37.1,17.5 36.27,18.34 J10.14
BCM4
  Top 0.305: GREEN_LEDS.2 62.36,41.04 61.7,41.7 55.5,41.7 55.2,42 55.2,47.8 54.5,48.5 51.5,48.5 51,49 51,56.18 J1.7
  Top 0.406: GREEN_LEDS.2 62.36,23.96 60.9,22.5 60.9,20.15 GPIO-2.1
BCM5
  Top 0.305: J1.29 79,56.16 79,50.9 79.4,50.5 80.6,50.5 81.3,49.8 81.3,44.3 80.7,43.7 77.5,43.7 77.06,43.26 RED_LEDS.4 77.06,24.96 73.9,21.8 73.9,20.15 GPIO-1.1
BCM6
  Top 0.305: J1.31 81.5,51.5 82.6,50.4 82.6,43.3 82,42.7 78.3,42.7 78.06,42.46 RED_LEDS.5 78.06,24.26 76,22.2 GPIO-1.2
BCM7  (via drill 0.6)
  Top 0.305: J1.26 73.88,63.37 SHUTDOWN.2 73.8,63.45 73.8,63.9 74.2,64.3 93.3,64.3 94.2,63.4 94.2,54.6 94.6,54.2 97.6,54.2 98.1,53.7 98.1,13.9 97.4,13.2 93.7,13.2 92.2,11.7 92.2,6 91.6,5.4 50.9,5.4 v49.1,7.2 | MC_I2C_PORT.4 49.06,9.14 v49.1,9.2
  Bottom 0.305: v49.1,9.2 v49.1,7.2
BCM8
  Top 0.305: J1.24 71.34,64.24 72.2,65.1 97.3,65.1 98.7,63.8 98.7,13.5 97.7,12.5 94,12.5 92.9,11.4 92.9,5.6 91.9,4.6 49,4.5 47.1,6.4 47.1,12.53 MC_I2C_PORT.2
BCM9
  Top 0.305: RED_LEDS.2 75.06,41.24 74.4,41.9 71.3,41.9 70.5,42.7 70.5,52.2 69.9,52.8 69.2,52.8 68.8,53.2 J1.21
BCM10
  Top 0.305: GREEN_LEDS.6 66.36,43.46 66.8,43.9 69.3,43.9 69.7,44.3 69.7,51 69,51.7 66.9,51.7 66.3,52.3 66.3,56.16 J1.19
BCM11
  Top 0.305: RED_LEDS.3 76.06,42.24 75.5,42.8 71.8,42.8 71.4,43.2 71.4,56.14 J1.23
BCM12
  Top 0.305: PWM.1 74,53.3 74.5,53.8 77.1,53.8 77.7,54.4 77.7,56.9 78.3,57.5 80.2,57.5 81,58.3 81.34,58.7 J1.32
BCM13  (via drill 0.6)
  Top 0.305: J1.33 84.1,56.14 v84.1,44.8 84.1,42.2 83.8,41.9 79.3,41.9 79.06,41.66 RED_LEDS.6
  Bottom 0.305: PWM.2 76,45.2 76.5,44.8 v84.1,44.8
  Bottom 0.406: LEDS.4 85.6,53.2 84.1,54.7 84.1,56.14 J1.33
BCM14_TX  (via drill 0.6)
  Top 0.305: SERIAL.2 63,52.4 61.7,53.6 60.6,53.6 59.9,54.3 59.9,59.7 59.1,60.4 51.86,60.4 51,59.7 51.02,59.68 J1.8 | v31.76,31.34 46.11,31.34 v46.64,31.37 | v28.4,31.3 28.1,31.3 27.5,32.1 27.5,34.3 26.7,35.1 U1.4
  Bottom 0.305: v46.64,31.37 62,31.37 63,32.37 SERIAL.2 | v31.76,31.34 28.43,31.34 v28.4,31.3
BCM15_RX  (via drill 0.6)
  Top 0.305: 53.6,58.78 J1.10 54.8,57.5 57,57.5 57.4,57.1 57.4,53.8 58.7,52.7 60.3,52.7 61,52.1 SERIAL.1 | v46.63,32.91 v31.76,32.91 | v25.4,31.3 U1.1
  Bottom 0.305: 60.95,46.2 SERIAL.1 61,33.55 60.3,32.84 46.9,32.84 v46.63,32.91 | v31.76,32.91 31.41,32.91 31.4,32.9 28.8,32.9 26.7,31.3 v25.4,31.3 | v25.4,31.3 25.3,31.3 v25.4,31.3 v25.39,31.3 v25.4,31.3
BCM16
  Top 0.305: J1.36 86.66,58.74 87.8,57.6 87.8,48.4 88.6,47.6 89.8,47.6 90.4,47 90.4,39.41 BUTTONS.3
  Top 0.406: GPIO-3.2 89,21.4 90.5,22.9 90.5,38.63 BUTTONS.3
BCM17
  Top 0.305: GREEN_LEDS.3 63.36,41.64 62.6,42.4 56.8,42.4 56.1,43.1 J1.11
  Top 0.406: GPIO-2.2 63,22.4 63.36,22.76 GREEN_LEDS.3
BCM19
  Top 0.305: BUTTONS.2 89.46,46.04 89,46.5 87.7,46.5 86.6,47.5 86.6,56.18 J1.35
  Top 0.406: GPIO-3.1 87,21.7 89.5,24.2 89.5,38.63 BUTTONS.2
  Bottom 0.406: LEDS.3 86.6,56.18 J1.35
BCM20
  Top 0.305: BUTTONS.5 92.46,48.64 91.7,49.5 90.8,49.5 90.4,49.9 90.4,57.46 J1.38
BCM21
  Top 0.305: BUTTONS.6 93.46,58.04 92.8,58.7 91.7,58.7 J1.40
BCM22
  Top 0.305: GREEN_LEDS.5 65.36,44.26 66.1,45 68.2,45 68.7,45.5 68.7,50.3 68.2,50.8 64.9,50.8 64,51.7 64,53.4 62.9,54.5 61.5,54.5 61.2,54.8 61.2,56.18 J1.15
BCM25
  Top 0.305: U4.2 69,62.8 69.5,62.3 69.5,61.3 68.8,60.6 J1.22
BCM26
  Top 0.305: BUTTONS.4 91.46,47.94 90.8,48.6 89.8,48.6 89.2,49.2 89.2,56.12 J1.37
  Bottom 0.406: LEDS.2 87.6,53.1 89.2,54.7 89.2,56.12 J1.37
BCM27  (via drill 0.6)
  Top 0.305: GREEN_LEDS.4 64.36,41.94 63,43.3 59,43.3 58.6,43.7 v58.6,51.2
  Bottom 0.305: v58.6,51.2 58.6,56.16 J1.13
D+
  Top 0.406: J4.D+1 9.97,34.03 10.15,34.21 A.2
D-
  Top 0.406: J4.D-1 11.2,31.97 B.2
GND  (via drill 0.6)
  Top 0.305: BUTTONS.1 88.46,40.24 v88.1,40.7 | GREEN_LEDS.1 61.36,39.54 61,39.9 v59.4,39.9 | RED_LEDS.1 74.06,40.44 v73.7,40.8 | U2.2 U2.1 42.7,42.11 v43.6,42.1 | v34.7,44.7 36.25,44.6 U2.6 | U4.1 U4.5 66.24,61.81 66.24,59.12 J1.20 | U5.3 39.2,17 39.2,18 | 39.2,18 U5.1 | 39.2,18 v39.2,19 C5.2 | D5.C 3,55.25 JP2.1 | 9.7,36.7 7.9,36.7 7.5,37.1 7.85,37.1 8.4,36.55
  Top 0.406: C4.2 v25.9,49.3 | 34.7,48.5 v34.7,47.5 | MC_I2C_PORT.1 46.06,14.26 v46,14.3 | C1.2 v20.2,26.4 | SHUTDOWN.1 80.15,62.15 78.9,60.9 78.9,58.8 J1.30 | v9.6,36.6 14.97,36.6 16.46,35.11 U1.5
  Top 0.61: D6.C v22.6,60.4 | C3.2 v40.36,60.97 | C2.2 34.7,48.5
  Top 0.813: U3.1 v36.49,51.21 v36.5,51.2
  Top 1.422: J4.GND1 8.4,36.55 9.95,36.55
  Bottom 0.406: 24.1,26.2 24.9,26.1
  other vias: 8.6,36.6 7.6,36.6 7.6,37.9 8.6,37.9 9.6,37.9 7.6,39.1 8.6,39.1 9.6,39.1 6.6,39.1 6.6,37.9
  pour Bottom (isolate 0.305, rank 6, no thermals): -3.7,66 100.9,66.9 101,-0.7 -2.2,-3.3
  pour Top: 5.6,36 10.1,36 10.1,39.5 9.8,39.8 5.9,39.8 5.6,39.5
N$2
  Top 0.406: R5.2 D6.A
N$4
  Top 0.305: R4.2 D5.A
N$6
  Top 0.305: RTS.1 23.84,33.8 U1.3
  Top 0.406: U1.3 U1.2
N$8
  Top 0.305: NEOPIXELS.2 56.06,62.24 56.7,61.6 60.8,61.6 61.3,62.1 R3.1
N$9
  Top 0.305: 63.5,63.8 R3.2 | 65.65,63.8 U4.4
  Top 0.406: 65.65,63.8 R3.2
PI_3V3
  Top 1.93: J1.1 J7.1
PI_5V
  Top 0.406: R1.2 33.1,63 33.1,60.3 32.5,59.4 32.5,43.8 32.8,43.4 35.95,43.4 U2.7 | NEOPIXELS.3 53.52,65.02 53.8,65.3 68.7,65.3 69,65 69,63.75 U4.3
  Top 0.61: C3.1 34.96,60.97 34.9,60.7
  Top 1.27: U3.3 34.9,60.7 34.9,62.5 33.7,63.1
  Top 1.676: 33.7,63.1 R1.2 | 43.4,62.8 43.3,63.1 | 45.94,62.56 46,63.1
  Top 2.184: J1.4 45.94,62.56
  Top 2.54: NEOPIXELS.3 46,63.1 43.3,63.1 33.7,63.1 | J1.2 43.4,62.8
RS485_A
  Top 0.406: U1.6 16.32,33.84 15.95,34.21 A.1
RS485_B
  Top 0.406: U1.7 16.84,32.56 15.95,31.67 B.1
RTS
  Top 0.305: RTS.2 28.36,36.34 R2.1
SCL
  Top 0.305: 48,44.9 I2C-2.1 I2C-3.1 I2C-4.1 47.95,20.1 43,20.1 42.15,19.25 U5.10 | 48,44.9 I2C-1.1 48,53.8 48.4,54.7 48.4,56.22 J1.5 | 47.99,45.91 48,44.9 | MC_I2C_PORT.3 48,12.51 48,8.5 48.4,8.1 54.1,8.1 54.7,8.7 54.7,11.2 55.37,11.87 DISPLAY.3 56.63,11.9 R7.2
  Top 0.406: MC_I2C_PORT.3 48,13.3 I2C-4.1 | U2.4 46.3,45.91 46.8,46.4 47.95,46.4 I2C-1.1
SDA  (via drill 0.6)
  Top 0.305: I2C-4.2 I2C-3.2 I2C-2.2 I2C-1.2 50,47.4 49.8,47.6 49.8,57.1 49.4,57.5 46.64,57.5 46,56.9 45.94,56.84 J1.3 | U2.3 45.06,44.63 v45.4,44.6 | U5.9 43.4,17.5 44.1,18.2 v46.5,18.2 | MC_I2C_PORT.5 50.1,12.53 50.1,9.2 50.6,8.7 53.5,8.7 54,9.2 54,13.9 54.61,14.51 56.4,14.5 56.49,14.41 DISPLAY.4 56.69,14.5 R6.2
  Top 0.406: I2C-4.2 50,13.4 MC_I2C_PORT.5
  Bottom 0.305: v45.4,44.6 49.5,44.6 50,45.1 I2C-1.2 | v46.5,18.2 49.3,18.2 50,18.9 I2C-4.2

### Text on the board
tNames: 5V | 3v3 | + | LM1117-3.3 / Max 800mA | GND | Pi 3v3 | Connect to use / Raspi 3v3 | 5V DC IN | + | 5V / DC | SCL | SDA | 3v3 | RX | TX | 12 | 13 | 3v3 | GND | 3v3 | GND | GND | Power & RS485 Bus | RS485 Bus / D+ -> A / D- -> B | GND | 4 | 17 | 27 | 22 | 10 | GND | 9 | 11 | 5 | 6 | 13 | GND | 19 | 16 | 26 | 20 | 21 | SCL | SDA | 3v3 | GND | Status Board | Github.com/ThingySticks/PiBlade | 5V | 3v3 | SCL | SDA | 3v3 | GND | 3v3 | 4 | 17 | 5 | 6 | 19 | 16 | SCL | SDA | 3v3 | GND | 3v3 | GND | 3v3 | GND | 3v3 | GND | A0 | A1 | ADC | A2 | A3 | A4 | Pi Blade Mc Power Connector | GND | GND | Mc I2C Port: / 1 GND / 2 BCM8 / 3 SCL / 4 BCM7 / 5 SDA / 6 3v3 | McPiFace.com | V1.0
bNames: 5V DC | + | Front Panel / LEDs | GND | + | RS485 / D+ -> A / D- -> B | V1.0 | 23 Jan 2019 | S.Harrison